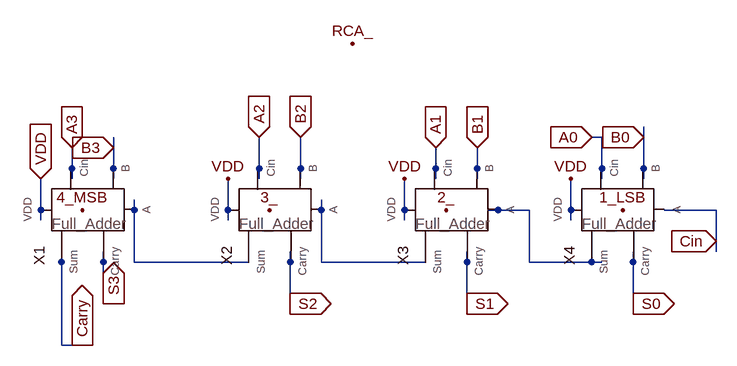
[diagram p0: schematic RCA_.asc]
RCA_.asc, the LTspice schematic file:
Version 4
SHEET 1 880 680
WIRE 544 112 528 112
WIRE 608 112 608 96
WIRE -208 128 -208 112
WIRE -272 160 -272 128
WIRE -208 160 -208 128
WIRE 16 160 16 112
WIRE 80 160 80 112
WIRE 288 160 288 128
WIRE 352 160 352 128
WIRE 544 160 544 112
WIRE 608 160 608 112
WIRE -272 176 -272 160
WIRE -208 176 -208 160
WIRE 16 176 16 160
WIRE 80 176 80 160
WIRE 288 176 288 160
WIRE 352 176 352 160
WIRE 544 176 544 160
WIRE 608 176 608 160
WIRE -320 224 -320 176
WIRE -176 224 -176 208
WIRE -32 224 -32 176
WIRE 112 224 112 208
WIRE 240 224 240 176
WIRE 384 224 368 224
WIRE 432 224 384 224
WIRE 496 224 496 176
WIRE 720 224 640 224
WIRE -320 240 -320 224
WIRE -32 240 -32 224
WIRE 240 240 240 224
WIRE 496 240 496 224
WIRE 720 272 720 224
WIRE 720 288 720 272
WIRE -288 304 -288 288
WIRE -224 304 -224 288
WIRE -176 304 -176 224
WIRE 0 304 -176 304
WIRE 64 304 64 288
WIRE 112 304 112 224
WIRE 272 304 112 304
WIRE 336 304 336 288
WIRE 432 304 432 224
WIRE 528 304 432 304
WIRE 544 304 528 304
WIRE 592 304 592 288
WIRE -224 368 -224 304
WIRE -208 368 -224 368
WIRE -192 368 -208 368
WIRE 64 368 64 304
WIRE 336 368 336 304
WIRE 592 368 592 304
WIRE 64 384 64 368
WIRE 336 384 336 368
WIRE 592 384 592 368
WIRE -288 432 -288 304
WIRE -256 432 -288 432
WIRE -240 432 -256 432
FLAG 576 224 1_LSB
FLAG 304 224 2_
FLAG 32 224 3_
FLAG -256 224 4_MSB
FLAG 160 -32 RCA_
FLAG 592 368 S0
IOPIN 592 368 Out
FLAG 336 368 S1
IOPIN 336 368 Out
FLAG 64 368 S2
IOPIN 64 368 Out
FLAG -208 368 S3
IOPIN -208 368 Out
FLAG -256 432 Carry
IOPIN -256 432 Out
FLAG 528 112 A0
IOPIN 528 112 In
FLAG 608 112 B0
IOPIN 608 112 In
FLAG 288 128 A1
IOPIN 288 128 In
FLAG 352 128 B1
IOPIN 352 128 In
FLAG 16 112 A2
IOPIN 16 112 In
FLAG 80 112 B2
IOPIN 80 112 In
FLAG -272 128 A3
IOPIN -272 128 In
FLAG -208 128 B3
IOPIN -208 128 In
FLAG 720 272 Cin
IOPIN 720 272 In
FLAG 496 176 VDD
FLAG 240 176 VDD
FLAG -32 176 VDD
FLAG -320 176 VDD
IOPIN -320 176 In
SYMBOL Full_Adder -304 256 R90
SYMATTR InstName X1
SYMBOL Full_Adder -16 256 R90
SYMATTR InstName X2
SYMBOL Full_Adder 256 256 R90
SYMATTR InstName X3
SYMBOL Full_Adder 512 256 R90
SYMATTR InstName X4

The netlist it stands for:
* RCA_.asc
XX1 N001 B3 A3 VDD Carry S3 Full_Adder  ; pins A B Cin VDD Sum Carry
XX2 N002 B2 A2 VDD N001 S2 Full_Adder  ; pins A B Cin VDD Sum Carry
XX3 N003 B1 A1 VDD N002 S1 Full_Adder  ; pins A B Cin VDD Sum Carry
XX4 Cin B0 A0 VDD N003 S0 Full_Adder  ; pins A B Cin VDD Sum Carry
.backanno
.end